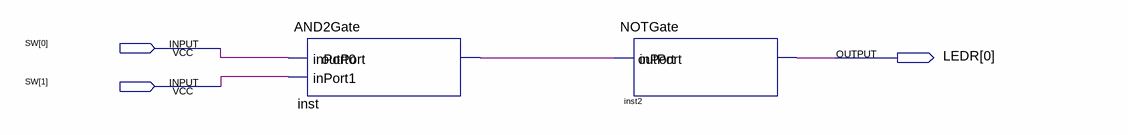
[diagram p0: schematic sheet]
// Quartus schematic GateDiagram.bdf as structural Verilog: 2 symbols, 3 pins
module GateDiagram (
  input  [1:0] SW,
  output [0:0] LEDR
);

  wire inst_outport;

  AND2Gate inst (.inPort0(SW[0]), .inPort1(SW[1]), .outPort(inst_outport));
  NOTGate inst2 (.inPort(inst_outport), .outPort(LEDR[0]));
endmodule
